# EAGLE schematic RC-car-Adruino (EAGLE 9.6.2)
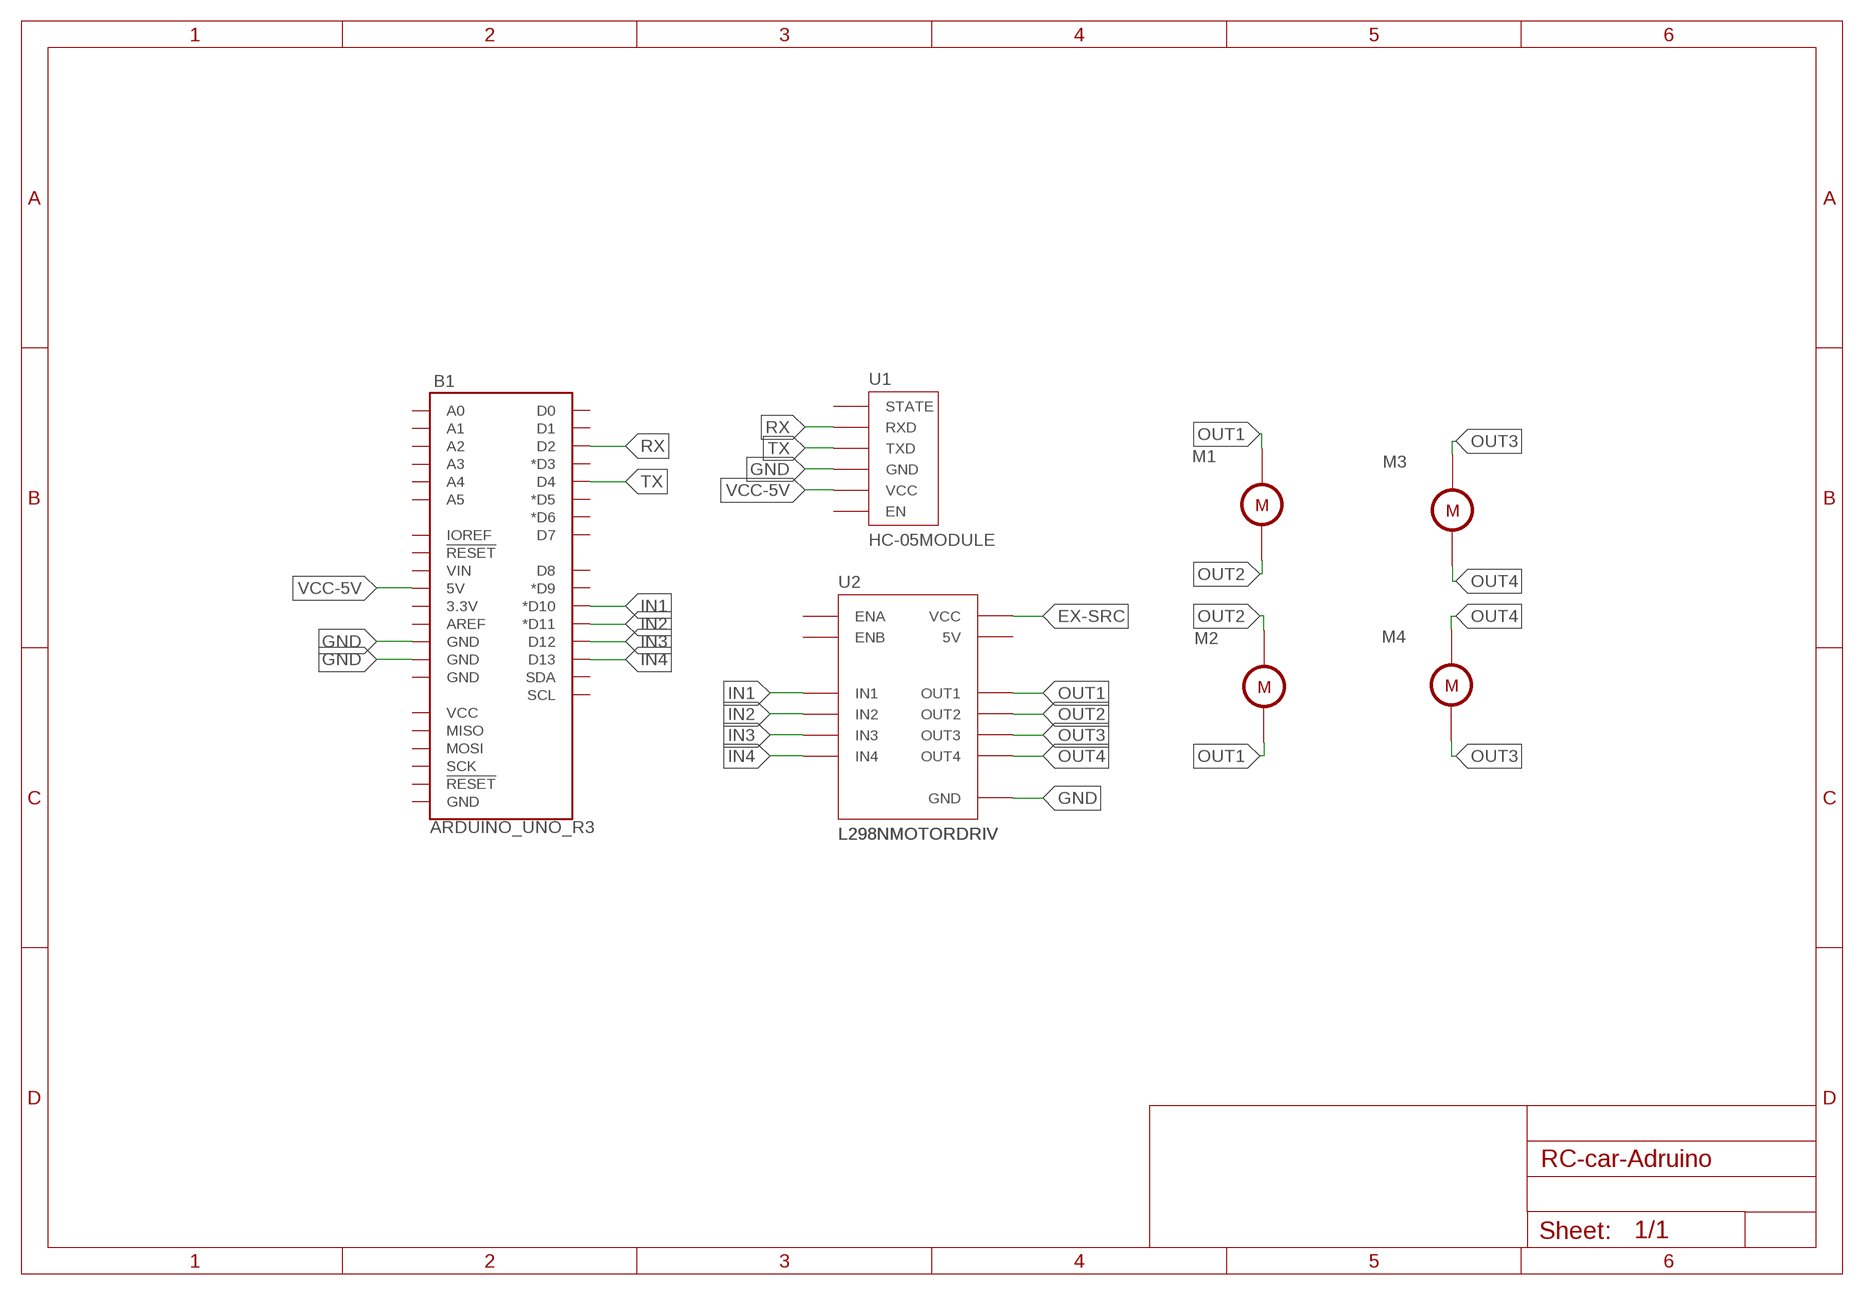
[diagram p0: schematic, sheet 1]

## Parts
B1  ARDUINO_UNO_R3  [ARDUINO_R3]
M1  DC-MOTOR  [DC-MOTOR]
M2  DC-MOTOR  [DC-MOTOR]
M3  DC-MOTOR  [DC-MOTOR]
M4  DC-MOTOR  [DC-MOTOR]
U1  HC-05MODULE  [HC-05MODULE]
U2  L298NMOTORDRIV  [L289NMOTORDRIV]

## Nets
EX-SRC: U2.VCC
GND: B1.GND@3(GND) B1.GND@4(GND) U1.GND U2.GND
IN1: B1.D10(*D10) U2.IN1
IN2: B1.D11(*D11) U2.IN2
IN3: B1.D12 U2.IN3
IN4: B1.D13 U2.IN4
OUT1: M1.+ M2.- U2.OUT1
OUT2: M1.- M2.+ U2.OUT2
OUT3: M3.+ M4.- U2.OUT3
OUT4: M3.- M4.+ U2.OUT4
RX: B1.D2 U1.RXD
TX: B1.D4 U1.TXD
VCC-5V: B1.5V U1.VCC
Unconnected: B1.3.3V B1.A0 B1.A1 B1.A2 B1.A3 B1.A4 B1.A5 B1.AREF B1.D0 B1.D1 B1.D3(*D3) B1.D5(*D5) B1.D6(*D6) B1.D7 B1.D8 B1.D9(*D9) B1.GND@1(GND) B1.GND@2(GND) B1.IOREF B1.MISO B1.MOSI B1.RESET@1(!RESET!) B1.RESET@2(!RESET!) B1.SCK B1.SCL B1.SDA B1.VCC B1.VIN U1.EN U1.STATE U2.5V U2.ENA U2.ENB

## Library data of the parts
B1 = SparkFun-Boards:ARDUINO_UNO_R3: Arduino R3 Footprint with SPI header Arduino Uno R3 Compatible Footprint. Matches PCB size of the original board. SparkFun Products: SAMD21 Dev Breakout <https://www.sparkfun.com/products/13672> RedBoard <https://www.sparkfun.com/products/12757> R3 Stackable Headers <https://www.sparkfun.com/products/11417>
M1-M4 = DC-MOTOR:DC-MOTOR
U1 = HC-05MODULE:HC-05MODULE
U2 = L298NMOTORDRIV:L298NMOTORDRIV